# Altium schematic sheet Sheet_PIC.SchDoc
size A3
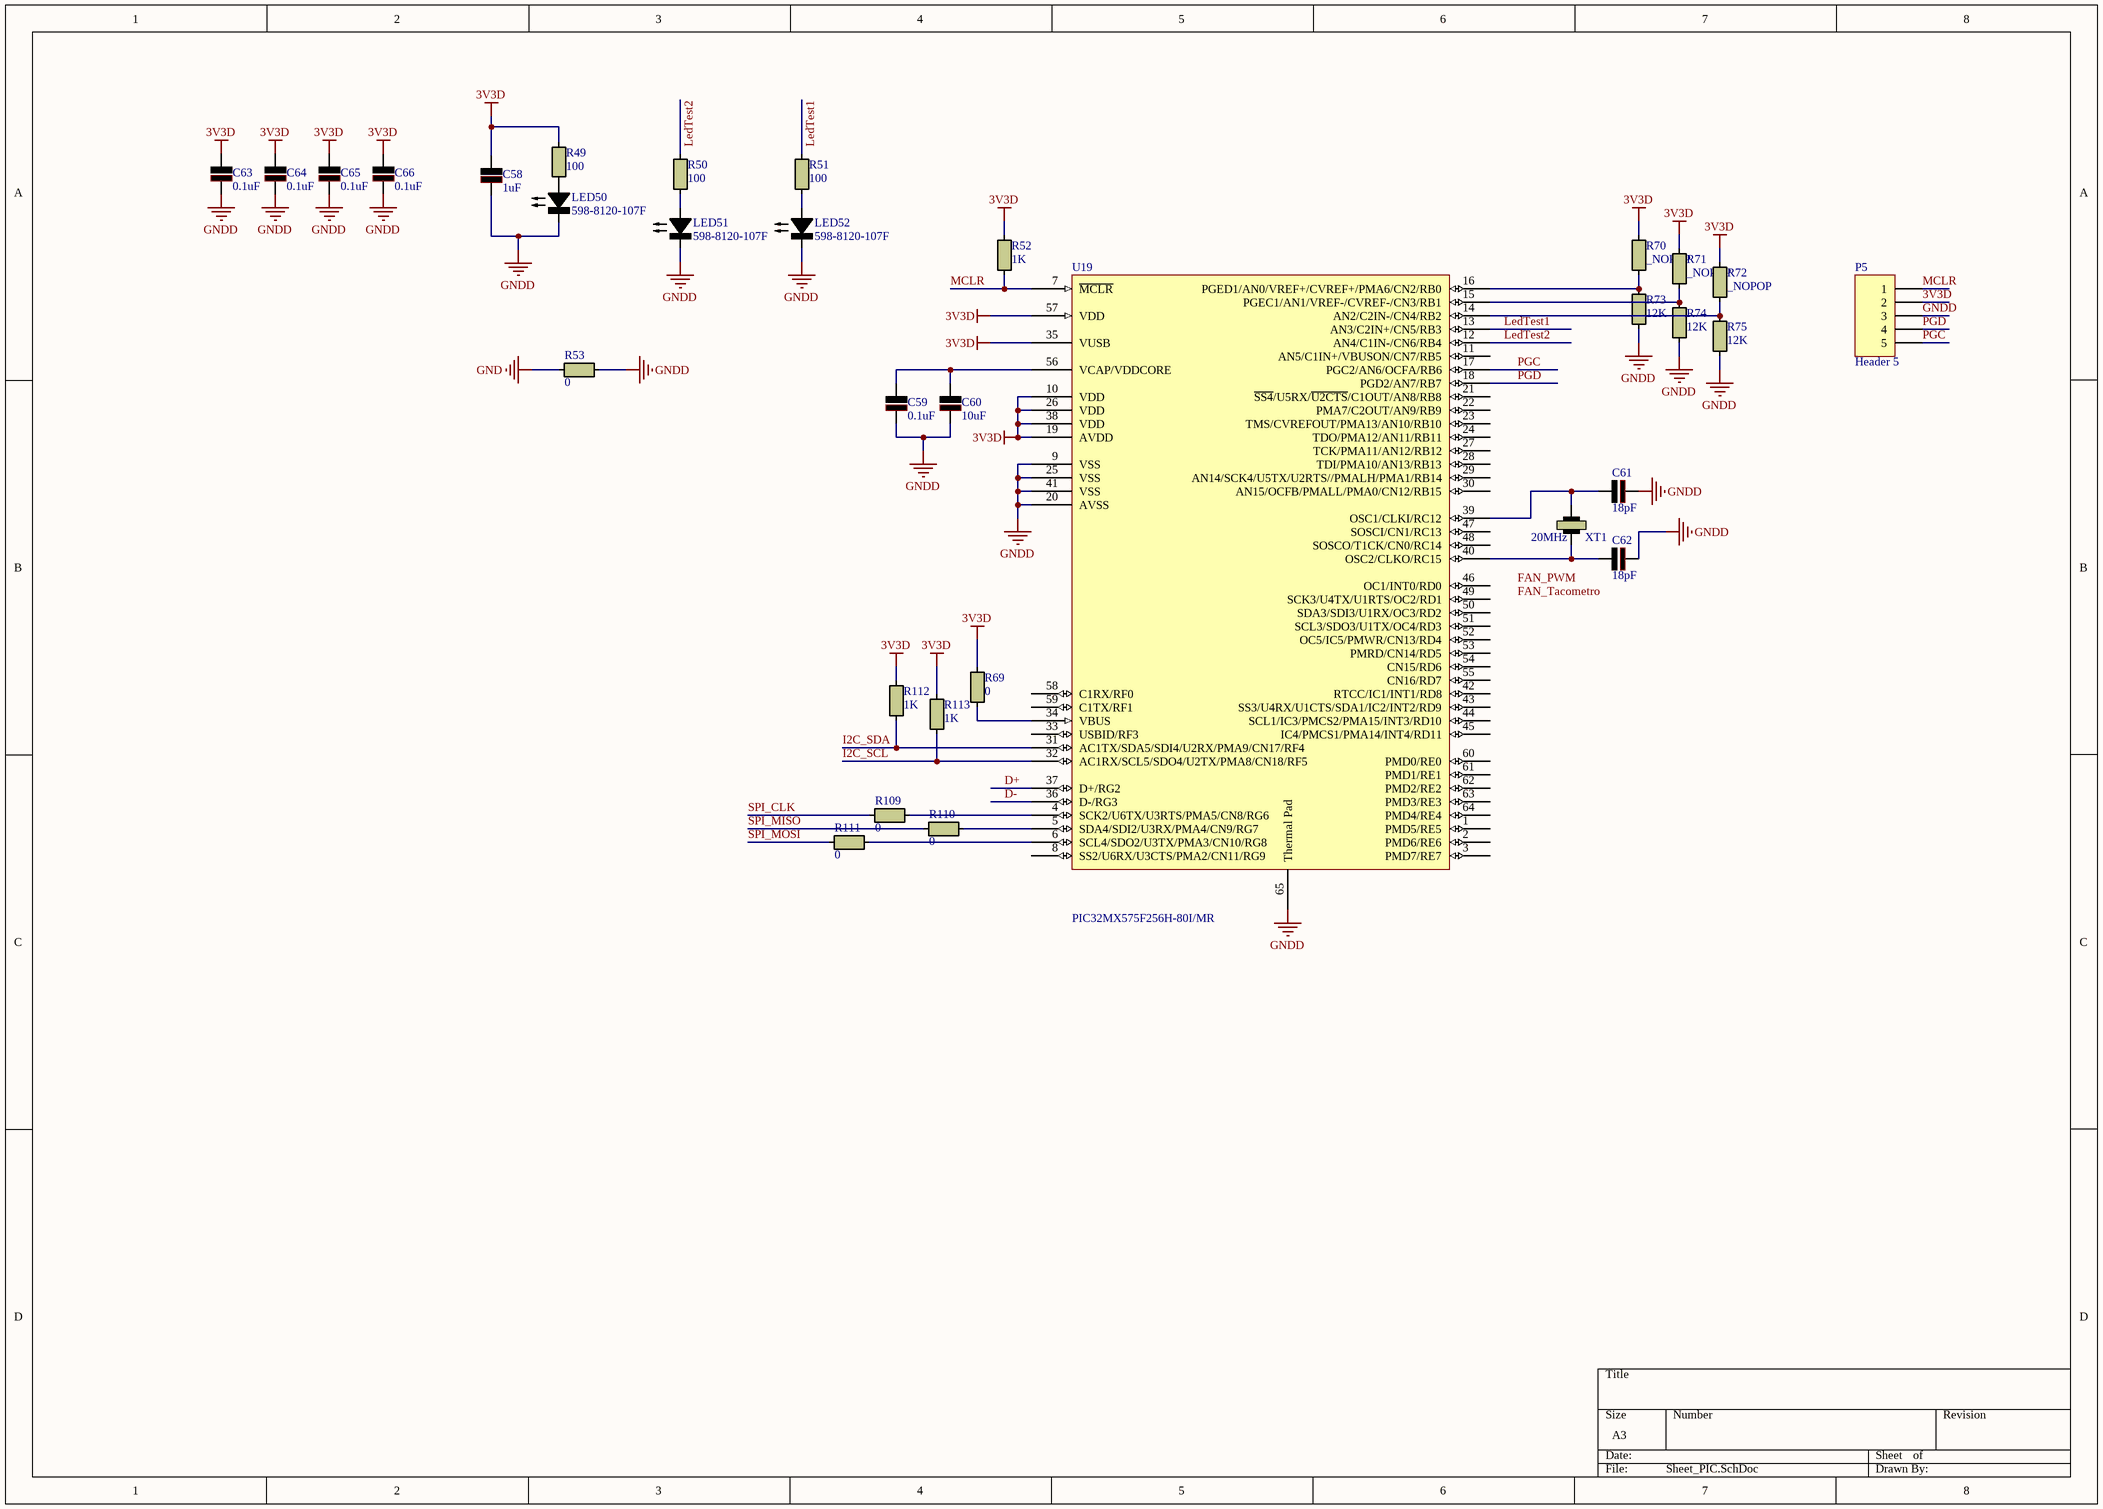
[diagram p0: Sheet_PIC.SchDoc]

## Parts
C58  1uF  [C_0805]
C59  0.1uF  [C_0402]
C60  10uF  [C_0805]
C61  18pF  [C_0402]
C62  18pF  [C_0402]
C63  0.1uF  [C_0402]
C64  0.1uF  [C_0402]
C65  0.1uF  [C_0402]
C66  0.1uF  [C_0402]
LED50  598-8120-107F  [LED_0805]
LED51  598-8120-107F  [LED_0805]
LED52  598-8120-107F  [LED_0805]
P5  Header 5  [header5_molex_53398_1.25_vertical]
R49  100  [R_0402]
R50  100  [R_0402]
R51  100  [R_0402]
R52  1K  [R_0402]
R53  0  [R_0805]
R69  0  [R_0402]
R70  _NOPOP  [R_0402]
R71  _NOPOP  [R_0402]
R72  _NOPOP  [R_0402]
R73  12K  [R_0402]
R74  12K  [R_0402]
R75  12K  [R_0402]
R109  0  [R_0402]
R110  0  [R_0402]
R111  0  [R_0402]
R112  1K  [R_0402]
R113  1K  [R_0402]
U19  PIC32MX575F256H-80I/MR
XT1  20MHz  [XTAL_ABM7]

## Nets
3V3D: C58.1 C63.1 C64.1 C65.1 C66.1 P5.2 R49.2 R52.1 R69.2 R70.1 R71.1 R72.1 R112.2 R113.2 U19.10(VDD) U19.19(AVDD) U19.26(VDD) U19.35(VUSB) U19.38(VDD) U19.57(VDD)
GND: R53.1
GNDD: C58.2 C59.2 C60.2 C61.2 C62.2 C63.2 C64.2 C65.2 C66.2 LED50.K LED51.K LED52.K P5.3 R53.2 R73.2 R74.2 R75.2 U19.9(VSS) U19.20(AVSS) U19.25(VSS) U19.41(VSS) U19.65(Thermal_Pad)
D+: U19.37(D+/RG2)
D-: U19.36(D-/RG3)
I2C_SCL: R113.1 U19.32(AC1RX/SCL5/SDO4/U2TX/PMA8/CN18/RF5)
I2C_SDA: R112.1 U19.31(AC1TX/SDA5/SDI4/U2RX/PMA9/CN17/RF4)
LedTest1: R51.2 U19.13(AN3/C2IN+/CN5/RB3)
LedTest2: R50.2 U19.12(AN4/C1IN-/CN6/RB4)
MCLR: P5.1 R52.2 U19.7(~{MCLR})
PGC: P5.5 U19.17(PGC2/AN6/OCFA/RB6)
PGD: P5.4 U19.18(PGD2/AN7/RB7)
SPI_CLK: R109.1
SPI_MISO: R110.1
SPI_MOSI: R111.1
NetC59_1: C59.1 C60.1 U19.56(VCAP/VDDCORE)
NetC61_1: C61.1 U19.39(OSC1/CLKI/RC12) XT1.2
NetC62_1: C62.1 U19.40(OSC2/CLKO/RC15) XT1.1
NetLED50_A: LED50.A R49.1
NetLED51_A: LED51.A R50.1
NetLED52_A: LED52.A R51.1
NetR69_1: R69.1 U19.34(VBUS)
NetR70_2: R70.2 R73.1 U19.16(PGED1/AN0/VREF+/CVREF+/PMA6/CN2/RB0)
NetR71_2: R71.2 R74.1 U19.15(PGEC1/AN1/VREF-/CVREF-/CN3/RB1)
NetR72_2: R72.2 R75.1 U19.14(AN2/C2IN-/CN4/RB2)
NetR109_2: R109.2 U19.4(SCK2/U6TX/U3RTS/PMA5/CN8/RG6)
NetR110_2: R110.2 U19.5(SDA4/SDI2/U3RX/PMA4/CN9/RG7)
NetR111_2: R111.2 U19.6(SCL4/SDO2/U3TX/PMA3/CN10/RG8)

Not connected (* = marked no-connect by the designer): U19 1(PMD5/RE5) 2(PMD6/RE6) 3(PMD7/RE7) 8(SS2/U6RX/U3CTS/PMA2/CN11/RG9) 11(AN5/C1IN+/VBUSON/CN7/RB5) 21(~{SS4}/U5RX/~{U2CTS}/C1OUT/AN8/RB8) 22(PMA7/C2OUT/AN9/RB9) 23(TMS/CVREFOUT/PMA13/AN10/RB10) 24(TDO/PMA12/AN11/RB11) 27(TCK/PMA11/AN12/RB12) 28(TDI/PMA10/AN13/RB13) 29(AN14/SCK4/U5TX/U2RTS//PMALH/PMA1/RB14) 30(AN15/OCFB/PMALL/PMA0/CN12/RB15) 33(USBID/RF3) 42(RTCC/IC1/INT1/RD8) 43(SS3/U4RX/U1CTS/SDA1/IC2/INT2/RD9) 44(SCL1/IC3/PMCS2/PMA15/INT3/RD10) 45(IC4/PMCS1/PMA14/INT4/RD11) 46(OC1/INT0/RD0) 47(SOSCI/CN1/RC13) 48(SOSCO/T1CK/CN0/RC14) 49(SCK3/U4TX/U1RTS/OC2/RD1) 50(SDA3/SDI3/U1RX/OC3/RD2) 51(SCL3/SDO3/U1TX/OC4/RD3) 52(OC5/IC5/PMWR/CN13/RD4) 53(PMRD/CN14/RD5) 54(CN15/RD6) 55(CN16/RD7) 58(C1RX/RF0) 59(C1TX/RF1) 60(PMD0/RE0) 61(PMD1/RE1) 62(PMD2/RE2) 63(PMD3/RE3) 64(PMD4/RE4)

## Notes on the sheet
- Labels drawn without touching a wire or pin: FAN_PWM, FAN_Tacometro

## Library data of the parts
C58-C66 = C: Precio: 0,553; Código Mouser: 647-UCL1E331MNL1GS
LED50-LED52 = LED: Precio: 0,099; Código Mouser: 859-LTST-S220EKT
P5 = Header 5: Header, 5-Pin; LatestRevisionDate: 17-Jul-2002; LatestRevisionNote: Re-released for DXP Platform.; Publisher: Altium Limited
R49-R53 R69-R75 R109-R113 = R: Precio: 0,05; Código Mouser: Variable
U19 = PIC32MX575F256H-80I/PT
XT1 = XTAL: Precio: 0,285; Código Mouser: 815-ABLS-4.0M-T